# Altium schematic sheet PracticePCB.SchDoc
size A; SheetNumber: 1; SheetTotal: 1
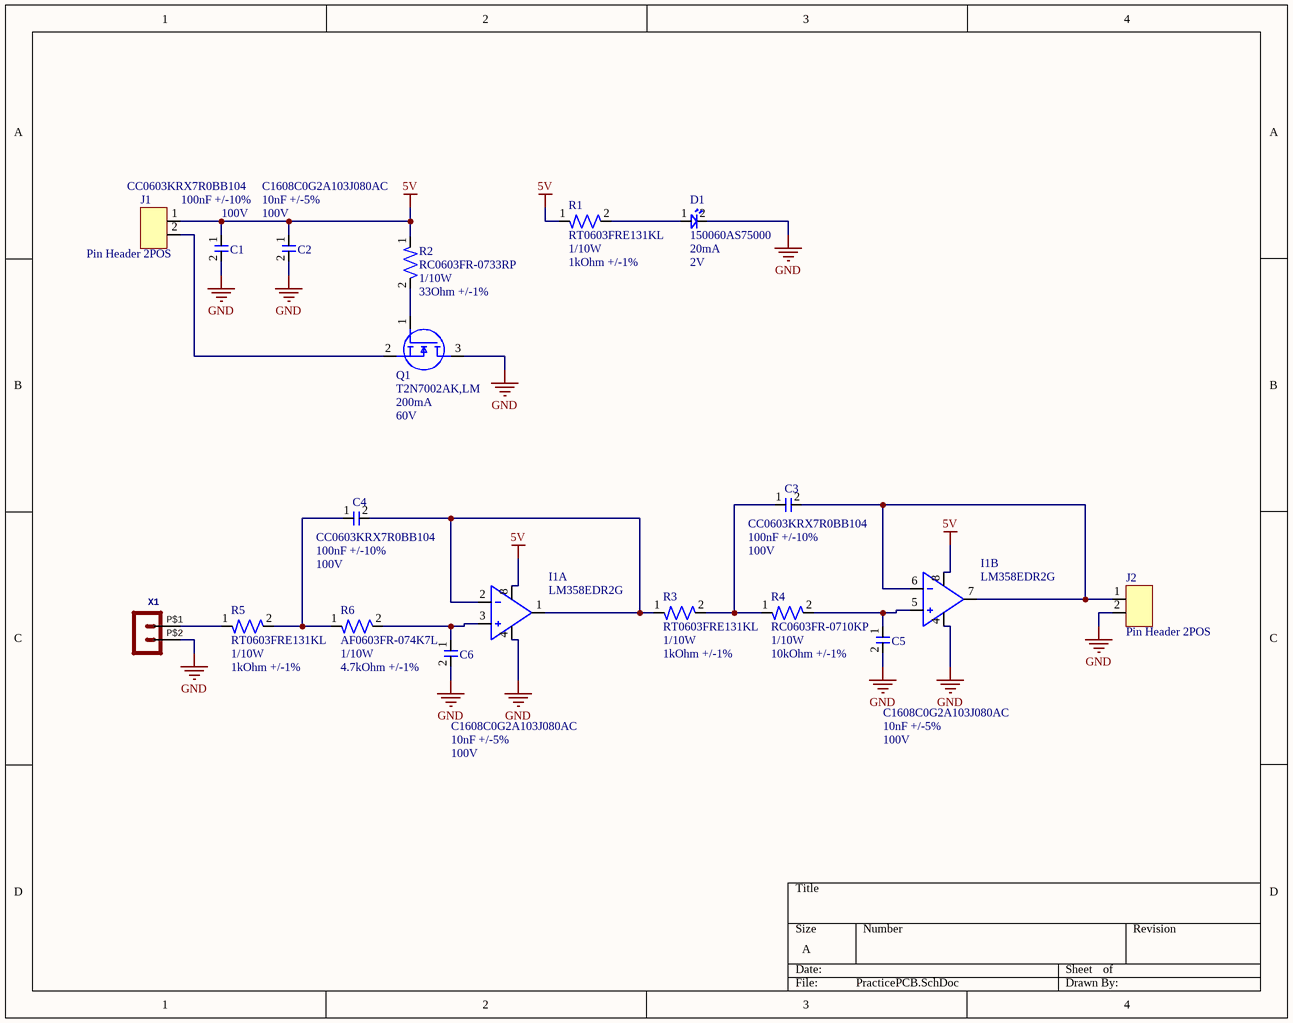
[diagram p0: PracticePCB.SchDoc]

## Parts
C1  CC0603KRX7R0BB104  Capacitance: 100nF +/-10%  Voltage Rating: 100V  [CAP-0603]
C2  C1608C0G2A103J080AC  Capacitance: 10nF +/-5%  Voltage Rating: 100V  [CAP-0603]
C3  CC0603KRX7R0BB104  Capacitance: 100nF +/-10%  Voltage Rating: 100V  [CAP-0603]
C4  CC0603KRX7R0BB104  Capacitance: 100nF +/-10%  Voltage Rating: 100V  [CAP-0603]
C5  C1608C0G2A103J080AC  Capacitance: 10nF +/-5%  Voltage Rating: 100V  [CAP-0603]
C6  C1608C0G2A103J080AC  Capacitance: 10nF +/-5%  Voltage Rating: 100V  [CAP-0603]
D1  150060AS75000  Current Rating: 20mA  Vf: 2V  [LED-0603]
I1  LM358EDR2G  [IC-OPAMP-0001]  (parts A,B of 2)
J1  Pin Header 2POS  [CON-2POS-0001]
J2  Pin Header 2POS  [CON-2POS-0001]
Q1  T2N7002AK,LM  Id-Continuous: 200mA  VDS-Max: 60V  [NMOS-SOT23-3]
R1  RT0603FRE131KL  Power Rating: 1/10W  Resistance: 1kOhm +/-1%  [RES-0603]
R2  RC0603FR-0733RP  Power Rating: 1/10W  Resistance: 33Ohm +/-1%  [RES-0603]
R3  RT0603FRE131KL  Power Rating: 1/10W  Resistance: 1kOhm +/-1%  [RES-0603]
R4  RC0603FR-0710KP  Power Rating: 1/10W  Resistance: 10kOhm +/-1%  [RES-0603]
R5  RT0603FRE131KL  Power Rating: 1/10W  Resistance: 1kOhm +/-1%  [RES-0603]
R6  AF0603FR-074K7L  Power Rating: 1/10W  Resistance: 4.7kOhm +/-1%  [RES-0603]
X1  Molex - Micro-Fit 3.0 Series connector,  3.00mm (0.118") pitch header, 2 positions.  [44914-0201]  (value not drawn)

## Nets
5V: C1.1 C2.1 I1.8 J1.1 R1.1 R2.1
GND: C1.2 C2.2 C5.2 C6.2 D1.2 I1.4 J2.2 Q1.3(D) X1.P$2
NetC3_1: C3.1 R3.2 R4.1
NetC3_2: C3.2 I1.6 I1.7 J2.1
NetC4_1: C4.1 R5.2 R6.1
NetC4_2: C4.2 I1.1 I1.2 R3.1
NetC5_1: C5.1 I1.5 R4.2
NetC6_1: C6.1 I1.3 R6.2
NetD1_1: D1.1 R1.2
NetJ1_2: J1.2 Q1.2(S)
NetQ1_1: Q1.1(G) R2.2
NetR5_1: R5.1 X1.P$1

## Library data of the parts
C1 C3 C4 = CAP-100N-0001: CAP CER 0.1UF 100V X7R 0603; Manufacturer: YAGEO; Assembled?: no; Manufacturer Part Number: CC0603KRX7R0BB104; Temperature Coefficient: X7R; Package Size: 0603
C2 C5 C6 = CAP-10N-0002: CAP CER 10000PF 100V C0G 0603; Manufacturer: TDK Corporation; Temperature Coefficient: C0G/NP0; Assembled?: no; Manufacturer Part Number: C1608C0G2A103J080AC; Package Size: 0603
D1 = LED_Amber_0001: CAP CER 0.1UF 100V X7R 0603; Manufacturer: Wurth Electronik; Assembled?: no; Color: Amber; Manufacturer Part Number: 150060AS75000; Package Size: 0603
I1 = IC-OPAMP-0001: IC OPAMP GP 2 CIRCUIT 8SOIC; Manufacturer: onsemi; CMRR: 70dB; Rail-to-Rail?: no; Supply Current - Max: 3mA; VCC-Max: 32V; VCC-Min: 3V; Assembled?: no; Manufacturer Part Number: LM358EDR2G; Package: 8-SOIC
J1 J2 = CON-2POS-0001: Assembled?: no; Rows: 1; Pins: 2
Q1 = NMOS-200MA-0001: MOSFET N-CH 60V 200MA SOT23; Manufacturer: Toshiba; FET type: N-Channel; Rds On-Max: 3.9Ohm; Vgs-Max: 20V; Assembled?: no; Manufacturer Part Number: T2N7002AK,LM; Package: SOT-23-3
R1 R3 R5 = RES-1K-0002: CHIP RESISTOR THIN FLIM HIGH PRE; Manufacturer: YAGEO; Assembled?: no; Manufacturer Part Number: RT0603FRE131KL; Package Size: 0603
R2 = RES-33-0002: RES SMD 33 OHM 1% 1/10W 0603; Manufacturer: YAGEO; Assembled?: no; Manufacturer Part Number: RC0603FR-0733RP; Package Size: 0603
R4 = RES-10K-0002: RES SMD 10K OHM 1% 1/10W 0603; Manufacturer: YAGEO; Assembled?: no; Manufacturer Part Number: RC0603FR-0710KP; Package Size: 0603
R6 = RES-4.7K-0002: RES SMD 4.7K OHM 1% 1/10W 0603; Manufacturer: YAGEO; Assembled?: no; Manufacturer Part Number: AF0603FR-074K7L; Package Size: 0603
X1 = HEADER_POS2_?44914-0201: GateName_1: G$1; SymbolName_1: HEADER_POS2; DeviceName: 44914-0201; LibraryName: con-molex-micro-fit-3_0_2; DeviceSetName: HEADER_POS2_?; Package: 44914-0201